# Altium schematic sheet MCU.SchDoc: MCU
size A4; Date: 15.03.2026; Author: Vamsi Krishna Sesham; DrawnBy: Vamsi Krishna Sesham; Engineer: Vamsi Krishna Sesham; Revision: C; SheetNumber: 2; SheetTotal: 6
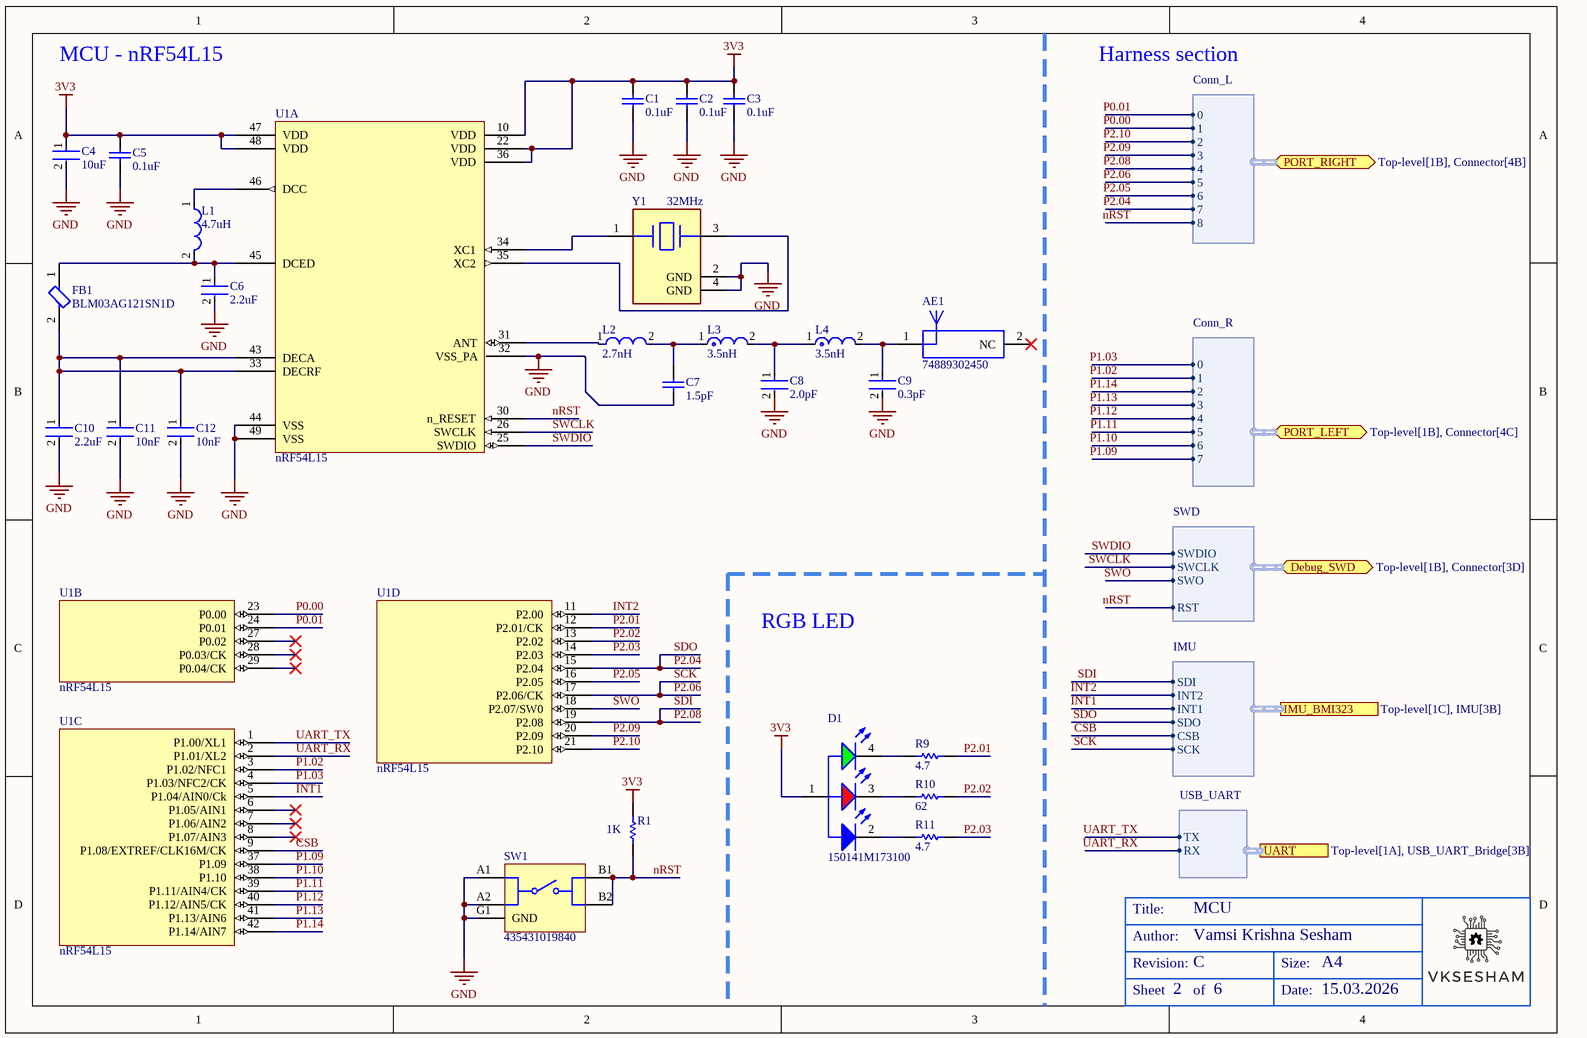
[diagram p0: MCU.SchDoc]

## Parts
*  TitleBlock  (value not drawn)  (graphical)
AE1  74889302450  [74889302450]
C1  0.1uF  [CAPC0603X33X15ML03T05]
C2  0.1uF  [CAPC0603X33X15ML03T05]
C3  0.1uF  [CAPC0603X33X15ML03T05]
C4  10uF  [FP-CL07-IPC_C]
C5  0.1uF  [CAPC0603X33X15ML03T05]
C6  2.2uF  [FP-CL03-IPC_B]
C7  1.5pF  [CAPC0603X33X15NL03T05]
C8  2.0pF  [FP-GRM033-0_03-MFG]
C9  0.3pF  [FP-GJM033-0_03-IPC_A]
C10  2.2uF  [FP-CL03-IPC_B]
C11  10nF  [FP-GRM033-0_03-IPC_B]
C12  10nF  [FP-GRM033-0_03-IPC_B]
D1  150141M173100  [WL-SFTW_3528_150141M173100]
FB1  BLM03AG121SN1D  [FP-BLM03-0_03-d0_3-IPC_A]
L1  4.7uH  [FP-MLZ1608-IPC_A]
L2  2.7nH  [FP-LQP03HQ_02-MFG]
L3  3.5nH  [FP-LQP03TG_02-IPC_C]
L4  3.5nH  [FP-LQP03TG_02-IPC_C]
R1  1K  [RESC0603X28X15ML05T05]
R9  4.7  [RESC0402(1005)_M]
R10  62  [RESC1005X40X25LL05T05]
R11  4.7  [RESC0402(1005)_M]
SW1  435431019840  [435431019840]
U1  nRF54L15  [nRF54L15_QFN8_6X6]  (parts A,B,C,D of 4)
Y1  32MHz  [FP-ABM8G-MFG]

## Ports
Debug_SWD (bidir, harness SWD, see Top-level[1B], Connector[3D]), IMU_BMI323 (harness IMU, see Top-level[1C], IMU[3B]), PORT_LEFT (bidir, harness Conn_R, see Top-level[1B], Connector[4C]), PORT_RIGHT (bidir, harness Conn_L, see Top-level[1B], Connector[4B]), UART (harness USB_UART, see Top-level[1A], USB_UART_Bridge[3B])

## Harnesses
USB_UART: TX, RX
IMU: SDI, INT2, INT1, SDO, CSB, SCK
SWD: SWDIO, SWCLK, SWO, RST
Conn_R: 0, 1, 2, 3, 4, 5, 6, 7
Conn_L: 0, 1, 2, 3, 4, 5, 6, 7, 8

## Nets
3V3: C1.2 C2.2 C3.2 C4.1 C5.2 D1.1(A) R1.2 U1.10(VDD) U1.22(VDD) U1.36(VDD) U1.47(VDD) U1.48(VDD)
GND: C1.1 C2.1 C3.1 C4.2 C5.1 C6.2 C7.1 C8.2 C9.2 C10.2 C11.2 C12.2 SW1.A1 SW1.A2 SW1.G1(GND) U1.32(VSS_PA) U1.44(VSS) U1.49(VSS) Y1.2(GND) Y1.4(GND)
CSB: U1.9(P1.08/EXTREF/CLK16M/CK) ; port IMU_BMI323.CSB
INT1: U1.5(P1.04/AIN0/Ck) ; port IMU_BMI323.INT1
INT2: U1.11(P2.00) ; port IMU_BMI323.INT2
nRST: R1.1 SW1.B1 SW1.B2 U1.30(n_RESET) ; port Debug_SWD.RST, port PORT_RIGHT.8
P0.00: U1.23(P0.00) ; port PORT_RIGHT.1
P0.01: U1.24(P0.01) ; port PORT_RIGHT.0
P1.02: U1.3(P1.02/NFC1) ; port PORT_LEFT.1
P1.03: U1.4(P1.03/NFC2/CK) ; port PORT_LEFT.0
P1.09: U1.37(P1.09) ; port PORT_LEFT.7
P1.10: U1.38(P1.10) ; port PORT_LEFT.6
P1.11: U1.39(P1.11/AIN4/CK) ; port PORT_LEFT.5
P1.12: U1.40(P1.12/AIN5/CK) ; port PORT_LEFT.4
P1.13: U1.41(P1.13/AIN6) ; port PORT_LEFT.3
P1.14: U1.42(P1.14/AIN7) ; port PORT_LEFT.2
P2.01: R9.2 U1.12(P2.01/CK)
P2.02: R10.2 U1.13(P2.02)
P2.03: R11.2 U1.14(P2.03)
P2.04: U1.15(P2.04) ; port IMU_BMI323.SDO, port PORT_RIGHT.7  [also labelled SDO]
P2.05: U1.16(P2.05) ; port PORT_RIGHT.6
P2.06: U1.17(P2.06/CK) ; port IMU_BMI323.SCK, port PORT_RIGHT.5  [also labelled SCK]
P2.08: U1.19(P2.08) ; port IMU_BMI323.SDI, port PORT_RIGHT.4  [also labelled SDI]
P2.09: U1.20(P2.09) ; port PORT_RIGHT.3
P2.10: U1.21(P2.10) ; port PORT_RIGHT.2
SWCLK: U1.26(SWCLK) ; port Debug_SWD.SWCLK
SWDIO: U1.25(SWDIO) ; port Debug_SWD.SWDIO
SWO: U1.18(P2.07/SW0) ; port Debug_SWD.SWO
UART_RX: U1.2(P1.01/XL2) ; port UART.RX
UART_TX: U1.1(P1.00/XL1) ; port UART.TX
NetAE1_1: AE1.1(Feed) C9.1 L4.2
NetC6_1: C6.1 FB1.1 L1.2 U1.45(DCED)
NetC7_2: C7.2 L2.2 L3.1
NetC8_1: C8.1 L3.2 L4.1
NetC10_1: C10.1 C11.1 C12.1 FB1.2 U1.33(DECRF) U1.43(DECA)
NetD1_2: D1.2(K) R11.1
NetD1_3: D1.3(K) R10.1
NetD1_4: D1.4(K) R9.1
NetL1_1: L1.1 U1.46(DCC)
NetL2_1: L2.1 U1.31(ANT)
NetU1_34: U1.34(XC1) Y1.1
NetU1_35: U1.35(XC2) Y1.3

Not connected (* = marked no-connect by the designer): AE1 2(NC)*; U1 6(P1.05/AIN1)* 7(P1.06/AIN2)* 8(P1.07/AIN3)* 27(P0.02)* 28(P0.03/CK)* 29(P0.04/CK)*

## Notes on the sheet
- MCU - nRF54L15
- Harness section
- RGB LED
- (in symbol TitleBlock) Title:; Author:; Revision:; Size:; A4; Sheet; of; Date:

## Library data of the parts
AE1 = CMP-03913-126098687-1: 74889302450 Chip Antenna, 2.45Ghz, 3.2Mm X 1.6Mm X 1.2Mm Rohs Compliant: Yes; Current Rating: 2A; Impedance: 50Ω; RoHS: Compliant; Length: 3.2mm; Width: 1.6mm; NexarPartId: 126098687; Max Operating Temperature: 85°C; Min Operating Temperature: -40°C; Height: 1.2mm
C1-C3 C5 = CMP-2010-00674-1: Manufacturer: Samsung; Part Number: CL03A104KQ3NNNC
C4 = CMP-13271-002778-1: Cap Ceramic 10uF 10V X5R ±20% SMD 0402 +85°C Paper T/R; Length: 0.039inch; Mount: Surface Mount; Case Code (Imperial): 0402; Capacitance: 10uF; Max Operating Temperature: 85°C; Voltage Rating: 10V; Min Operating Temperature: -55°C; Case/Package: 0402; Thickness: 0.035inch; Width: 0.02inch; Case Code (Metric): 1005; Packaging: Tape and Reel; Tolerance: 20%
C6 C10 = CMP-13271-002263-1: Cap Ceramic 2.2uF 10V X5R ±20% Pad SMD 0201 +85°C T/R; Width: 0.012inch; Case Code (Imperial): 0201; Lead Free: Lead Free; Thickness: 0.013inch; Packaging: Tape and Reel; Capacitance: 2.2uF; Min Operating Temperature: -55°C; Case Code (Metric): 0603; Length: 0.024inch; Voltage Rating: 10V; Case/Package: 0201; Mount: Surface Mount; Tolerance: 20%; Max Operating Temperature: 85°C
C7 = CMP-1033-00061-2: Part Number: 02013A1R5CAT2A; Manufacturer: AVX Interconnect / Elco
C8 = CMP-2010-01348-2: Chip Multilayer Ceramic Capacitors for General Purpose, 0201, 2.0pF, C0G, 30ppm/°C, 0.25pF, 25V; Capacitance: 2pF; Voltage Rating (DC): 25V; Case Code (Metric): 0603; REACH SVHC: No SVHC; Length: 0.024inch; Height: 0.3mm; Case Code (Imperial): 0201; Min Operating Temperature: -55°C; Max Operating Temperature: 125°C; Mount: Surface Mount; Thickness: 0.013inch; Dielectric: C0G; Case/Package: 0201; Termination: SMD/SMT; Width: 0.012inch; Package Quantity: 15000; Voltage Rating: 25V; Packaging: Tape and Reel; Lead Free: Lead Free
C9 = CMP-2010-00788-2: Ceramic Capacitor 0.3pF ±0.05pF 25V C0G 0201 (0603 Metric); Case/Package: 0201; Capacitance: 0.3pF; Length: 0.6mm; Voltage Rating (DC): 25V; Max Operating Temperature: 125°C; Mount: Surface Mount; Depth: 0.3mm; Min Operating Temperature: -55°C; Voltage Rating: 25V; Case Code (Imperial): 0201; Dielectric: C0G; Package Quantity: 15000; Lead Free: Lead Free; Width: 0.3mm; Case Code (Metric): 0603; Height: 0.3mm; Radiation Hardening: No; Termination: SMD/SMT; Packaging: Tape and Reel; Thickness: 0.013inch
C11 C12 = CMP-2010-01684-2: Chip Multilayer Ceramic Capacitors for General Purpose, 0201, 10000pF, X7R, 15%, 10%, 10V; Package Quantity: 1; Width: 0.012inch; Voltage: 10V; Mount: Surface Mount; Capacitance: 10nF; Voltage Rating (DC): 10V; Voltage Rating: 10V; Length: 0.6mm; Packaging: Tape and Reel; Material: Ceramic; Dielectric: X7R; REACH SVHC: No SVHC; Termination: SMD/SMT; Case/Package: 0201; Radiation Hardening: No; Height: 0.3mm; Tolerance: 10%; Case Code (Imperial): 0201; Min Operating Temperature: -55°C; Lead Free: Lead Free; Thickness: 0.013inch; Depth: 0.3mm; Case Code (Metric): 0603; Max Operating Temperature: 125°C
D1 = CMP-1431-00001-2: NexarPartId: 29717795; Forward Current: 100mA; Peak Wavelength: 465nm; Viewing Angle: 120°; Color: Green, Red; Max Reverse Voltage (DC): 5V; Forward Voltage: 3.2V; Dominant Wavelength: 520nm; Test Current: 20mA; Power Dissipation: 72mW; Wavelength: 470nm; Lens Style: Clear, Round; Luminous Intensity: 230mcd; Case/Package: 1411; Packaging: Tape and Reel; Case Code (Metric): 3528; Min Operating Temperature: -40°C; Length: 3.5mm; Number of Pins: 4; Width: 2.8mm; Max Operating Temperature: 85°C; Case Code (Imperial): 1411; Height: 1.9mm; REACH SVHC: Unknown; Mount: Surface Mount; RoHS: Compliant
FB1 = CMP-0686-00046-3: Ferrite Bead, 0201, 120Ω @ 100MHz, 25%, 0.5Ω, 200mA; Number of Lines: 1; Impedance: 120R; DC Resistance (DCR): 500mR; Shielding: Unshielded; Material: Steel; Max Current Rating: 200mA; Tolerance: 25%; Case Code (Metric): 0603; Max DC Current: 200mA; Max Operating Temperature: 125°C; Length: 0.6mm; Test Frequency: 100MHz; Package Quantity: 1; Height: 0.3mm; Case Code (Imperial): 0201; Case/Package: 0201; DC Resistance-Max: 500mR; Termination: SMD/SMT; Min Operating Temperature: -55°C; Series: BLM03AG; Core Material: Ferrite; Depth: 0.33mm; Lead Free: Lead Free; Packaging: Tape and Reel; Frequency: 100MHz; Number of Circuits: 1; REACH SVHC: No SVHC; Number of Pins: 2; Current Rating: 200mA; Width: 0.3mm; RoHS Compliant: Yes
L1 = CMP-08253-000311-1: Shielded Multilayer Inductor 4.7uH ±20% 350mA 650mΩ SMD 0603; DC Resistance (DCR): 650mR; Test Frequency: 2MHz; Self Resonant Frequency: 80MHz; Core Material: Ferrite; Saturation Current: 120mA; Packaging: Tape and Reel; Width: 0.031inch; Height - Seated (Max): 0.037inch; Inductance: 4.7uH; Current Rating: 350mA; Max Operating Temperature: 125°C; Tolerance: 20%; Length: 0.063inch; Package Quantity: 4000; Case/Package: 0603; Case Code (Imperial): 0603; Min Operating Temperature: -55°C; Case Code (Metric): 1608; RoHS Compliant: Yes; Shielding: Shielded; Mount: Surface Mount
L2 = CMP-06042-004733-1: Film type RF Inductor 2.7nH ±0.1nH 600mA 0.12Ω 0201 (0603); Self Resonant Frequency: 9GHz; Shielding: Unshielded; Test Frequency: 500MHz; DC Resistance (DCR): 120mR; Core Material: Non-Magnetic; Current Rating: 600mA; Max Operating Temperature: 125°C; Case/Package: 0201; Case Code (Metric): 0603; Inductance: 2.7nH; Case Code (Imperial): 0201; Min Operating Temperature: -55°C; Mount: Surface Mount; Resistor Type: Thin Film; Packaging: Tape and Reel
L3 L4 = CMP-06042-011870-1: Film type RF Inductor 3.5nH ±0.1nH 450mA 0.25Ω 0201 (0603); DC Resistance (DCR): 250mR; Shielding: Unshielded; Core Material: Non-Magnetic; Self Resonant Frequency: 7GHz; Q Factor: 14; Test Frequency: 500MHz; Current Rating: 450mA; Resistor Type: Thin Film; Max DC Current: 450mA; Case/Package: 0201; Case Code (Metric): 0603; Lead Free: Lead Free; Height: 0.3mm; Height - Seated (Max): 0.013inch; Case Code (Imperial): 0201; Length: 0.024inch; Packaging: Tape and Reel; Package Quantity: 15000; Mount: Surface Mount; Max Operating Temperature: 125°C; Termination: SMD/SMT; Width: 0.012inch; Min Operating Temperature: -55°C; Inductance: 3.5nH
R1 = CMP-2004-00209-1: Manufacturer: Vishay Dale; Part Number: CRCW02011K00FNED
R9 R11 = CMP-1011-00018-1: 4R7 0.063W 5% 0402 (1005 Metric)  SMD; Value: 4.70 Ohm; Case-EIA: 0402; Case-Metric: 1005; Power: 0.063 W; Technology: SMT; Tolerance: 5 %
R10 = CMP-2002-00152-1: Part Number: CRCW040262R0JNED; Manufacturer: Vishay Dale
SW1 = CMP-03913-134708202-2: Tactile Switch, 0.05A, 32VDC, SMD, 400GF Rohs Compliant: Yes; Voltage Rating: 32V; Current Rating: 50mA; Insulation Resistance: 1GΩ; RoHS: Compliant; Packaging: Tape and Reel; Max Operating Temperature: 125°C; Contact Plating: Silver; Min Operating Temperature: -55°C
U1 = nRF54L15_QFN8_6X6: Ultra-low-power wireless SoC; Manufacturer 1: Nordic Semiconductor; Manufacturer Part Number 1: NRF54L15-QFAA-R7
Y1 = CMP-27762-014975-1: Crystal 32MHz ±30ppm (Tol) ±30ppm (Stability) 10pF FUND 50Ω 4-Pin SMD T/R; ESR (Equivalent Series Resistance): 50R; Depth: 2.5mm; Frequency: 32MHz; Min Operating Temperature: -20°C; Lead Free: Lead Free; Termination: SMD/SMT; Load Capacitance: 10pF; Mount: Surface Mount; Max Operating Temperature: 70°C; Frequency Stability: 30ppm; Series: ABM8G; Tolerance: 30ppm; Width: 2.5mm; Packaging: Tape and Reel; Frequency Tolerance: 30ppm; Package Quantity: 1000; Series Resistance: 50R; Number of Pins: 4; Length: 3.2mm; Case/Package: CSMD; Height: 1mm